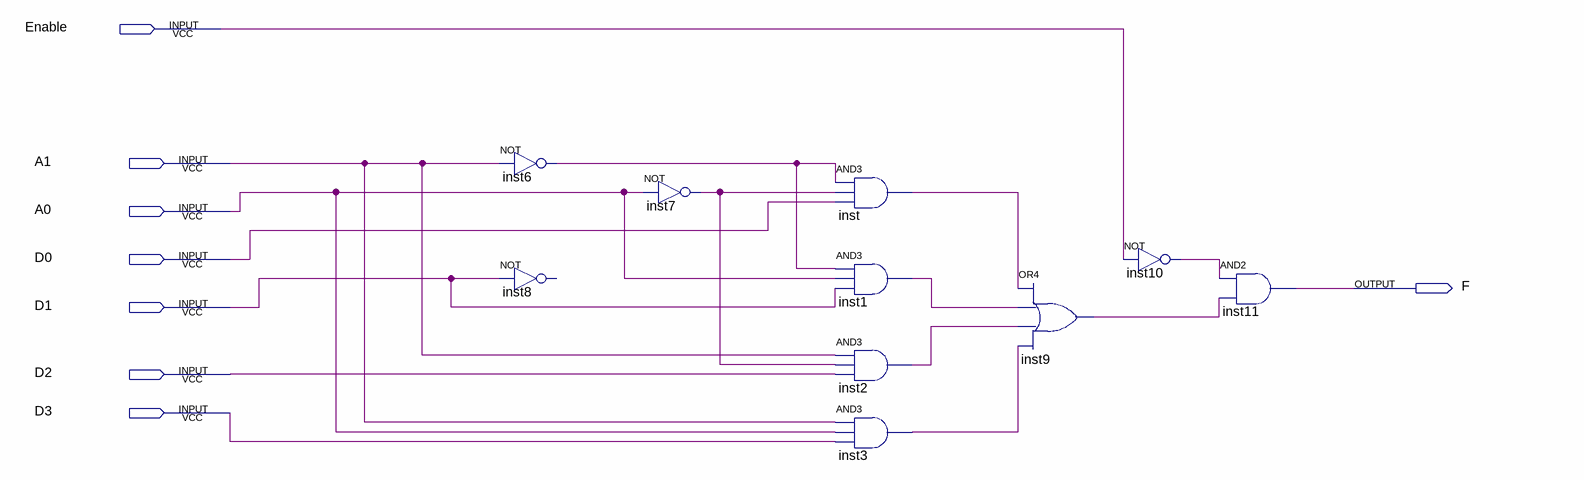
[diagram p0: schematic sheet]
// Quartus schematic multiplexer.bdf as structural Verilog: 10 symbols, 8 pins
module multiplexer (
  input  Enable,
  input  A1,
  input  A0,
  input  D0,
  input  D1,
  input  D2,
  input  D3,
  output F
);

  wire inst1_out, inst2_out, inst3_out, inst6_out, inst7_out, inst9_out, inst10_out, inst_out;

  not inst6 (inst6_out, A1);
  // NOT inst8 has open pins: IN=D1, OUT=open
  not inst7 (inst7_out, A0);
  and inst (inst_out, inst6_out, inst7_out, D0);
  and inst1 (inst1_out, inst6_out, A0, D1);
  and inst2 (inst2_out, A1, inst7_out, D2);
  and inst3 (inst3_out, A1, A0, D3);
  or inst9 (inst9_out, inst_out, inst1_out, inst2_out, inst3_out);
  not inst10 (inst10_out, Enable);
  and inst11 (F, inst10_out, inst9_out);
endmodule
